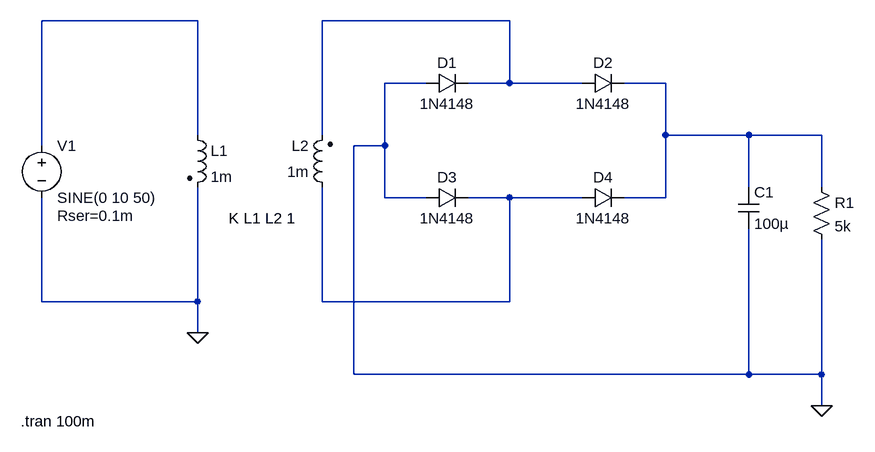
[diagram p0: schematic Full wave Bridge Rectifier.asc]
Full wave Bridge Rectifier.asc, the LTspice schematic file:
Version 4.1
SHEET 1 1208 680
WIRE 192 -48 -48 -48
WIRE 672 -48 384 -48
WIRE 544 48 480 48
WIRE 672 48 672 -48
WIRE 672 48 608 48
WIRE 784 48 672 48
WIRE 912 48 848 48
WIRE 192 128 192 -48
WIRE 384 128 384 -48
WIRE 912 128 912 48
WIRE 1040 128 912 128
WIRE 1152 128 1040 128
WIRE -48 144 -48 -48
WIRE 480 144 480 48
WIRE 480 144 432 144
WIRE 1040 208 1040 128
WIRE 1152 208 1152 128
WIRE 480 224 480 144
WIRE 544 224 480 224
WIRE 672 224 608 224
WIRE 784 224 672 224
WIRE 912 224 912 128
WIRE 912 224 848 224
WIRE -48 384 -48 224
WIRE 192 384 192 208
WIRE 192 384 -48 384
WIRE 384 384 384 208
WIRE 672 384 672 224
WIRE 672 384 384 384
WIRE 192 432 192 384
WIRE 432 496 432 144
WIRE 1040 496 1040 272
WIRE 1040 496 432 496
WIRE 1152 496 1152 288
WIRE 1152 496 1040 496
WIRE 1152 544 1152 496
FLAG 192 432 0
FLAG 1152 544 0
SYMBOL voltage -48 128 R0
WINDOW 123 0 0 Left 0
WINDOW 39 24 124 Left 2
SYMATTR SpiceLine Rser=0.1m
SYMATTR InstName V1
SYMATTR Value SINE(0 10 50)
SYMBOL ind2 176 112 R0
SYMATTR InstName L1
SYMATTR Value 1m
SYMATTR Type ind
SYMATTR SpiceLine Rser=1m
SYMBOL ind2 400 224 R180
WINDOW 0 36 80 Left 2
WINDOW 3 36 40 Left 2
SYMATTR InstName L2
SYMATTR Value 1m
SYMATTR Type ind
SYMATTR SpiceLine Rser=1m
SYMBOL diode 544 64 R270
WINDOW 0 32 32 VTop 2
WINDOW 3 0 32 VBottom 2
SYMATTR InstName D1
SYMATTR Value 1N4148
SYMBOL diode 784 64 R270
WINDOW 0 32 32 VTop 2
WINDOW 3 0 32 VBottom 2
SYMATTR InstName D2
SYMATTR Value 1N4148
SYMBOL diode 544 240 R270
WINDOW 0 32 32 VTop 2
WINDOW 3 0 32 VBottom 2
SYMATTR InstName D3
SYMATTR Value 1N4148
SYMBOL diode 784 240 R270
WINDOW 0 32 32 VTop 2
WINDOW 3 0 32 VBottom 2
SYMATTR InstName D4
SYMATTR Value 1N4148
SYMBOL cap 1024 208 R0
SYMATTR InstName C1
SYMATTR Value 100µ
SYMBOL res 1136 192 R0
SYMATTR InstName R1
SYMATTR Value 5k
TEXT -80 568 Left 2 !.tran 100m
TEXT 240 256 Left 2 !K L1 L2 1

The netlist it stands for:
* Full wave Bridge Rectifier.asc
V1 N001 0 SINE(0 10 50) Rser=0.1m
L1 N001 0 1m Rser=1m
L2 N004 N002 1m Rser=1m
D1 0 N002 1N4148
D2 N002 N003 1N4148
D3 0 N004 1N4148
D4 N004 N003 1N4148
C1 N003 0 100µ
R1 N003 0 5k
.model D D
.lib standard.dio
.tran 100m
K L1 L2 1
.backanno
.end